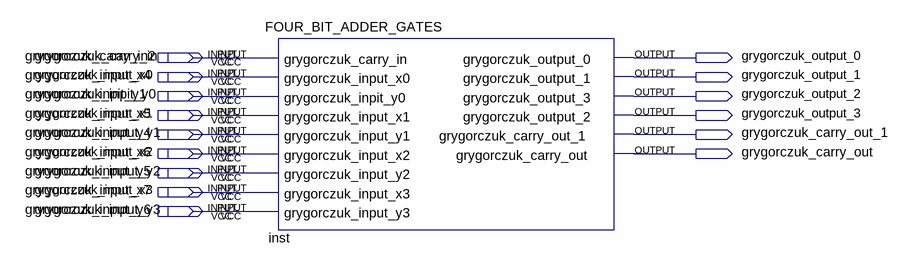
[diagram p0: schematic sheet]
// Quartus schematic FOUR_BIT_ADDER_SYMBOL.bdf as structural Verilog: 1 symbols, 24 pins
module FOUR_BIT_ADDER_SYMBOL (
  input  grygorczuk_carry_in2,
  input  grygorczuk_carry_in,
  input  grygorczuk_input_x4,
  input  grygorczuk_input_x0,
  input  grygorczuk_inpit_y1,
  input  grygorczuk_inpit_y0,
  input  grygorczuk_input_x5,
  input  grygorczuk_input_x1,
  input  grygorczuk_input_y4,
  input  grygorczuk_input_y1,
  input  grygorczuk_input_x6,
  input  grygorczuk_input_x2,
  input  grygorczuk_input_y5,
  input  grygorczuk_input_y2,
  input  grygorczuk_input_x7,
  input  grygorczuk_input_x3,
  input  grygorczuk_input_y6,
  input  grygorczuk_input_y3,
  output grygorczuk_output_0,
  output grygorczuk_output_1,
  output grygorczuk_output_2,
  output grygorczuk_output_3,
  output grygorczuk_carry_out_1,
  output grygorczuk_carry_out
);

  FOUR_BIT_ADDER_GATES inst (
    .grygorczuk_carry_in(grygorczuk_carry_in2), .grygorczuk_input_x0(grygorczuk_input_x4),
    .grygorczuk_inpit_y0(grygorczuk_inpit_y1), .grygorczuk_input_x1(grygorczuk_input_x5),
    .grygorczuk_input_y1(grygorczuk_input_y4), .grygorczuk_input_x2(grygorczuk_input_x6),
    .grygorczuk_input_y2(grygorczuk_input_y5), .grygorczuk_input_x3(grygorczuk_input_x7),
    .grygorczuk_input_y3(grygorczuk_input_y6), .grygorczuk_output_0(grygorczuk_output_0),
    .grygorczuk_output_1(grygorczuk_output_1), .grygorczuk_output_3(grygorczuk_output_2),
    .grygorczuk_output_2(grygorczuk_output_3), .grygorczuk_carry_out_1(grygorczuk_carry_out_1),
    .grygorczuk_carry_out(grygorczuk_carry_out));
endmodule
